# EAGLE schematic digitalDomain (EAGLE 8.7.1)
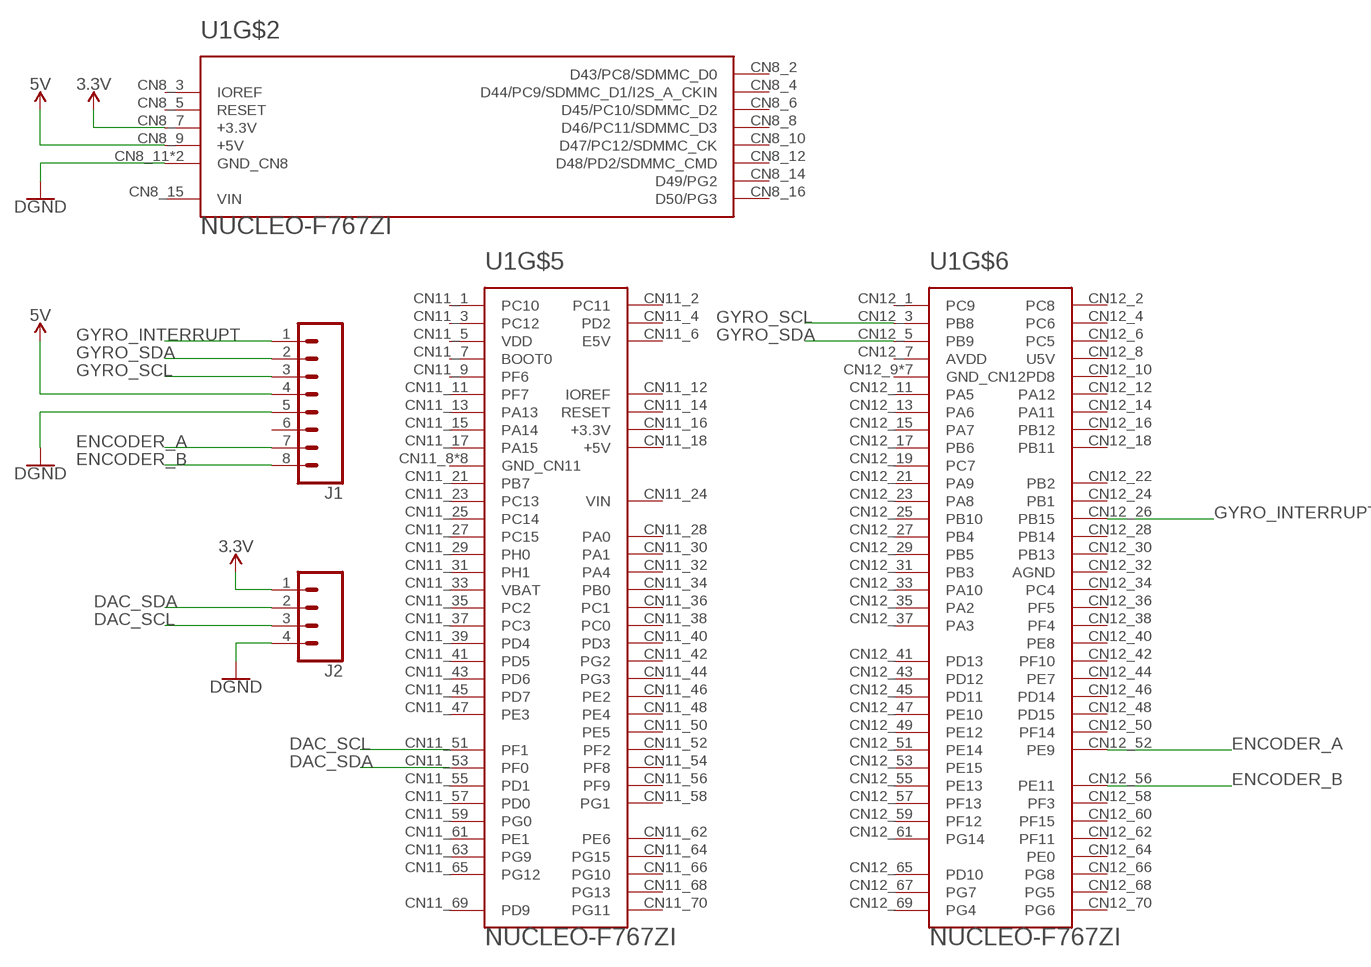
[diagram p0: schematic, sheet 1]

## Parts
J1  CONN_08LONGPADS  [1X08_LONGPADS]
J2  CONN_04LONGPADS  [1X04_LONGPADS]
U1  NUCLEO-F767ZI  [MODULE_NUCLEO-F429ZI]

## Nets
3.3V: J2.1 U1.CN8_7(+3.3V)
5V: J1.4 U1.CN8_9(+5V)
DAC_SCL: J2.3 U1.CN11_51(PF1)
DAC_SDA: J2.2 U1.CN11_53(PF0)
ENCODER_A: J1.7 U1.CN12_52(PE9)
ENCODER_B: J1.8 U1.CN12_56(PE11)
GND: J1.5 J2.4 U1.CN8_11(GND_CN8) U1.CN8_13(GND_CN8) ; supply symbol labelled DGND
GYRO_INTERRUPT: J1.1 U1.CN12_26(PB15)
GYRO_SCL: J1.3 U1.CN12_3(PB8)
GYRO_SDA: J1.2 U1.CN12_5(PB9)
Unconnected: J1.6 U1.CN7_1(D16/PC6/I2S_A_MCK) U1.CN7_2(D15/PB8/I2C_A_SCL) U1.CN7_3(D17/PB15/I2S_A_SD) U1.CN7_4(D14/PB9/I2C_A_SDA) U1.CN7_5(D18/PB13/I2S_A_CK) U1.CN7_6(AVDD) U1.CN7_7(D19/PB12/I2S_A_WS) U1.CN7_8(GND_CN7) U1.CN7_9(D20/PA15/I2S_B_WS) U1.CN7_10(D13/PA5/SPI_A_SCK) U1.CN7_11(D21/PC7/I2S_B_MCK) U1.CN7_12(D12/PA6/SPI_A_MISO) U1.CN7_13(D22/PB5/I2S_B_SD/SPI_B_MOSI) U1.CN7_14(D11/ETH/PA7/SPI_A_MOSI/TIM_E_PWM1) U1.CN7_15(D23/PB3/I2S_B_CK/SPI_B_SCK) U1.CN7_16(D10/PD14/SPI_A_CS/TIM_B_PWM3) U1.CN7_17(D24/PA4/SPI_B_NSS) U1.CN7_18(D9/PD15/TIMER_B_PWM2) U1.CN7_19(D25/PB4/SPI_B_MISO) U1.CN7_20(D8/PF12) U1.CN8_2(D43/PC8/SDMMC_D0) U1.CN8_3(IOREF) U1.CN8_4(D44/PC9/SDMMC_D1/I2S_A_CKIN) U1.CN8_5(RESET) U1.CN8_6(D45/PC10/SDMMC_D2) U1.CN8_8(D46/PC11/SDMMC_D3) U1.CN8_10(D47/PC12/SDMMC_CK) U1.CN8_12(D48/PD2/SDMMC_CMD) U1.CN8_14(D49/PG2) U1.CN8_15(VIN) U1.CN8_16(D50/PG3) U1.CN9_1(A0/PA3) U1.CN9_2(D51/PD7/USART_B_SCLK) U1.CN9_3(A1/PC0) U1.CN9_4(D52/PD6/USART_B_RX) U1.CN9_5(A2/PC3) U1.CN9_6(D53/PD5/USART_B_TX) U1.CN9_7(A3/PF3) U1.CN9_8(D54/PD4/USART_B_RTS) U1.CN9_9(A4/PF5) U1.CN9_10(D55/PD3/USART_B_CTS) U1.CN9_11(A5/PF10) U1.CN9_12(GND_CN9) U1.CN9_13(D72/NC) U1.CN9_14(D56/PE2/SAI_A_MCLK) U1.CN9_15(D71/PA7) U1.CN9_16(D57/PE4/SAI_A_FS) U1.CN9_17(D70/PF2/I2C_B_SMBA) U1.CN9_18(D58/PE5/SAI_A_SCK) U1.CN9_19(D69/PF1/I2C_B_SCL) U1.CN9_20(D59/PE6/SAI_A_SD) U1.CN9_21(D68/PF0/I2C_B_SDA) U1.CN9_22(D60/PE3/SAI_B_SD) U1.CN9_23(GND_CN9) U1.CN9_24(D61/PF8/SAI_B_SCK) U1.CN9_25(D67/PD0/CAN_RX) U1.CN9_26(D62/PF7/SAI_B_MCLK) U1.CN9_27(D66/PD1/CAN_TX) U1.CN9_28(D63/PF9/SAI_B_FS) U1.CN9_29(D65/PG0) U1.CN9_30(D64/PG1) U1.CN10_1(AVDD) U1.CN10_2(D7/PF13) U1.CN10_3(AGND) U1.CN10_4(D6/PE9/TIMER_A_PWM1) U1.CN10_5(GND_CN10) U1.CN10_6(D5/PE11/TIMER_A_PWM2) U1.CN10_7(A6/PB1/ADC_A_IN) U1.CN10_8(D4/PF14) U1.CN10_9(A7/PC2/ADC_B_IN) U1.CN10_10(D3/PE13/TIMER_A_PWM3) U1.CN10_11(A8/PF4/ADC_C_IN) U1.CN10_12(D2/PF15) U1.CN10_13(D26/PB6) U1.CN10_14(D1/PG14/USART_A_TX) U1.CN10_15(D27/PB2) U1.CN10_16(D0/PG9/USART_A_RX) U1.CN10_17(GND_CN10) U1.CN10_18(D42/PE8/TIMER_A_PWM1N) U1.CN10_19(D28/PD13) U1.CN10_20(D41/PE7/TIMER_A_ETR) U1.CN10_21(D29/PD12) U1.CN10_22(GND_CN10) U1.CN10_23(D30/PD11) U1.CN10_24(D40/PE10/TIMER_A_PWM2N) U1.CN10_25(D31/PE2) U1.CN10_26(D39/PE12/TIMER_A_PWM3N) U1.CN10_27(GND_CN10) U1.CN10_28(D38/PE14) U1.CN10_29(D32/PA0/TIMER_C_PWM1) U1.CN10_30(D37/PE15/TIMER_A_BKIN1) U1.CN10_31(D33/PB0/TIMER_D_PWM1) U1.CN10_32(D36/PB10/TIMER_C_PWM2) U1.CN10_33(D34/PE0/TIMER_B_ETR) U1.CN10_34(D35/PB11/TIMER_C_PWM3) U1.CN11_1(PC10) U1.CN11_2(PC11) U1.CN11_3(PC12) U1.CN11_4(PD2) U1.CN11_5(VDD) U1.CN11_6(E5V) U1.CN11_7(BOOT0) U1.CN11_8(GND_CN11) U1.CN11_9(PF6) U1.CN11_11(PF7) U1.CN11_12(IOREF) U1.CN11_13(PA13) U1.CN11_14(RESET) U1.CN11_15(PA14) U1.CN11_16(+3.3V) U1.CN11_17(PA15) U1.CN11_18(+5V) U1.CN11_19(GND_CN11) U1.CN11_20(GND_CN11) U1.CN11_21(PB7) U1.CN11_22(GND_CN11) U1.CN11_23(PC13) U1.CN11_24(VIN) U1.CN11_25(PC14) U1.CN11_27(PC15) U1.CN11_28(PA0) U1.CN11_29(PH0) U1.CN11_30(PA1) U1.CN11_31(PH1) U1.CN11_32(PA4) U1.CN11_33(VBAT) U1.CN11_34(PB0) U1.CN11_35(PC2) U1.CN11_36(PC1) U1.CN11_37(PC3) U1.CN11_38(PC0) U1.CN11_39(PD4) U1.CN11_40(PD3) U1.CN11_41(PD5) U1.CN11_42(PG2) U1.CN11_43(PD6) U1.CN11_44(PG3) U1.CN11_45(PD7) U1.CN11_46(PE2) U1.CN11_47(PE3) U1.CN11_48(PE4) U1.CN11_49(GND_CN11) U1.CN11_50(PE5) U1.CN11_52(PF2) U1.CN11_54(PF8) U1.CN11_55(PD1) U1.CN11_56(PF9) U1.CN11_57(PD0) U1.CN11_58(PG1) U1.CN11_59(PG0) U1.CN11_60(GND_CN11) U1.CN11_61(PE1) U1.CN11_62(PE6) U1.CN11_63(PG9) U1.CN11_64(PG15) U1.CN11_65(PG12) U1.CN11_66(PG10) U1.CN11_68(PG13) U1.CN11_69(PD9) U1.CN11_70(PG11) U1.CN11_71(GND_CN11) U1.CN11_72(GND_CN11) U1.CN12_1(PC9) U1.CN12_2(PC8) U1.CN12_4(PC6) U1.CN12_6(PC5) U1.CN12_7(AVDD) U1.CN12_8(U5V) U1.CN12_9(GND_CN12) U1.CN12_10(PD8) U1.CN12_11(PA5) U1.CN12_12(PA12) U1.CN12_13(PA6) U1.CN12_14(PA11) U1.CN12_15(PA7) U1.CN12_16(PB12) U1.CN12_17(PB6) U1.CN12_18(PB11) U1.CN12_19(PC7) U1.CN12_20(GND_CN12) U1.CN12_21(PA9) U1.CN12_22(PB2) U1.CN12_23(PA8) U1.CN12_24(PB1) U1.CN12_25(PB10) U1.CN12_27(PB4) U1.CN12_28(PB14) U1.CN12_29(PB5) U1.CN12_30(PB13) U1.CN12_31(PB3) U1.CN12_32(AGND) U1.CN12_33(PA10) U1.CN12_34(PC4) U1.CN12_35(PA2) U1.CN12_36(PF5) U1.CN12_37(PA3) U1.CN12_38(PF4) U1.CN12_39(GND_CN12) U1.CN12_40(PE8) U1.CN12_41(PD13) U1.CN12_42(PF10) U1.CN12_43(PD12) U1.CN12_44(PE7) U1.CN12_45(PD11) U1.CN12_46(PD14) U1.CN12_47(PE10) U1.CN12_48(PD15) U1.CN12_49(PE12) U1.CN12_50(PF14) U1.CN12_51(PE14) U1.CN12_53(PE15) U1.CN12_54(GND_CN12) U1.CN12_55(PE13) U1.CN12_57(PF13) U1.CN12_58(PF3) U1.CN12_59(PF12) U1.CN12_60(PF15) U1.CN12_61(PG14) U1.CN12_62(PF11) U1.CN12_63(GND_CN12) U1.CN12_64(PE0) U1.CN12_65(PD10) U1.CN12_66(PG8) U1.CN12_67(PG7) U1.CN12_68(PG5) U1.CN12_69(PG4) U1.CN12_70(PG6) U1.CN12_71(GND_CN12) U1.CN12_72(GND_CN12)

## Library data of the parts
J1 = SparkFun-Connectors:CONN_08: Multi connection point. Often used as Generic Header-pin footprint for 0.1 inch spaced/style header connections On any of the 0.1 inch spaced packages, you can populate with these: Break Away Headers - Straight <https://www.sparkfun.com/products/116> (PRT-00116) Break Away Male Headers - Right Angle <https://www.sparkfun.com/products/553> (PRT-00553) Female Headers <https://www.sparkfun.com/products/115> (PRT-00115) Break Away Headers - Machine Pin <https://www.sparkfun.com/products/117> (PRT-00117) Break Away Female Headers - Swiss Machine Pin <https://www.sparkfun.com/products/743> (PRT-00743) Arduino Stackable Header - 8 Pin <https://www.sparkfun.com/products/9279> (PRT-09279) For SCREWTERMINALS and SPRING TERMINALS visit here: Screw Terimnals on SparkFun.com <https://www.sparkfun.com/search/results?term=Screw+Terminals> (5mm/3.5mm/2.54mm spacing) This device is also useful as a general connection point to wire up your design to another part of your project. Our various solder wires solder well into these plated through hole pads. Hook-Up Wire - Assortment (Stranded, 22 AWG) <https://www.sparkfun.com/products/11375> (PRT-11375) Hook-Up Wire - Assortment (Solid Core, 22 AWG) <https://www.sparkfun.com/products/11367> (PRT-11367) View the entire wire category on our website here <https://www.sparkfun.com/categories/141> Special notes: Molex polarized connector foot print use with SKU : PRT-08231 with associated crimp pins and housings. 1MM SMD Version SKU: PRT-10208 NOTES ON THE VARIANTS LOCK and LOCK_LONGPADS... This footprint was designed to help hold the alignment of a through-hole component (i.e. 6-pin header) while soldering it into place. You may notice that each hole has been shifted either up or down by 0.005 of an inch from it's more standard position (which is a perfectly straight line). This slight alteration caused the pins (the squares in the middle) to touch the edges of the holes. Because they are alternating, it causes a "brace" to hold the component in place. 0.005 has proven to be the perfect amount of "off-center" position when using our standard breakaway headers. Although looks a little odd when you look at the bare footprint, once you have a header in there, the alteration is very hard to notice. Also,if you push a header all the way into place, it is covered up entirely on the bottom side.
J2 = SparkFun-Connectors:CONN_04: Multi connection point. Often used as Generic Header-pin footprint for 0.1 inch spaced/style header connections On any of the 0.1 inch spaced packages, you can populate with these: Break Away Headers - Straight <https://www.sparkfun.com/products/116> (PRT-00116) Break Away Male Headers - Right Angle <https://www.sparkfun.com/products/553> (PRT-00553) Female Headers <https://www.sparkfun.com/products/115> (PRT-00115) Break Away Headers - Machine Pin <https://www.sparkfun.com/products/117> (PRT-00117) Break Away Female Headers - Swiss Machine Pin <https://www.sparkfun.com/products/743> (PRT-00743) For SCREWTERMINALS and SPRING TERMINALS visit here: Screw Terimnals on SparkFun.com <https://www.sparkfun.com/search/results?term=Screw+Terminals> (5mm/3.5mm/2.54mm spacing) This device is also useful as a general connection point to wire up your design to another part of your project. Our various solder wires solder well into these plated through hole pads. Hook-Up Wire - Assortment (Stranded, 22 AWG) <https://www.sparkfun.com/products/11375> (PRT-11375) Hook-Up Wire - Assortment (Solid Core, 22 AWG) <https://www.sparkfun.com/products/11367> (PRT-11367) View the entire wire category on our website here <https://www.sparkfun.com/categories/141> Special notes: Molex polarized connector foot print use with SKU : PRT-08231 with associated crimp pins and housings. 1MM SMD Version SKU: PRT-10208; PROD_ID: CONN-09696
U1 = NUCLEO-F429ZI:NUCLEO-F767ZI: STM32 Nucleo-144 development board with STM32F429ZIT6 MCU, supports Arduino, ST Zio and Morpho; AVAILABILITY: Unavailable; DESCRIPTION: STM32 Nucleo-144 development board with STM32F429ZIT6 MCU, supports Arduino, ST Zio and Morpho; MF: STMicroelectronics; MP: NUCLEO-F429ZI; PACKAGE: None; PRICE: None